# Altium project F1C100S.PrjPCB
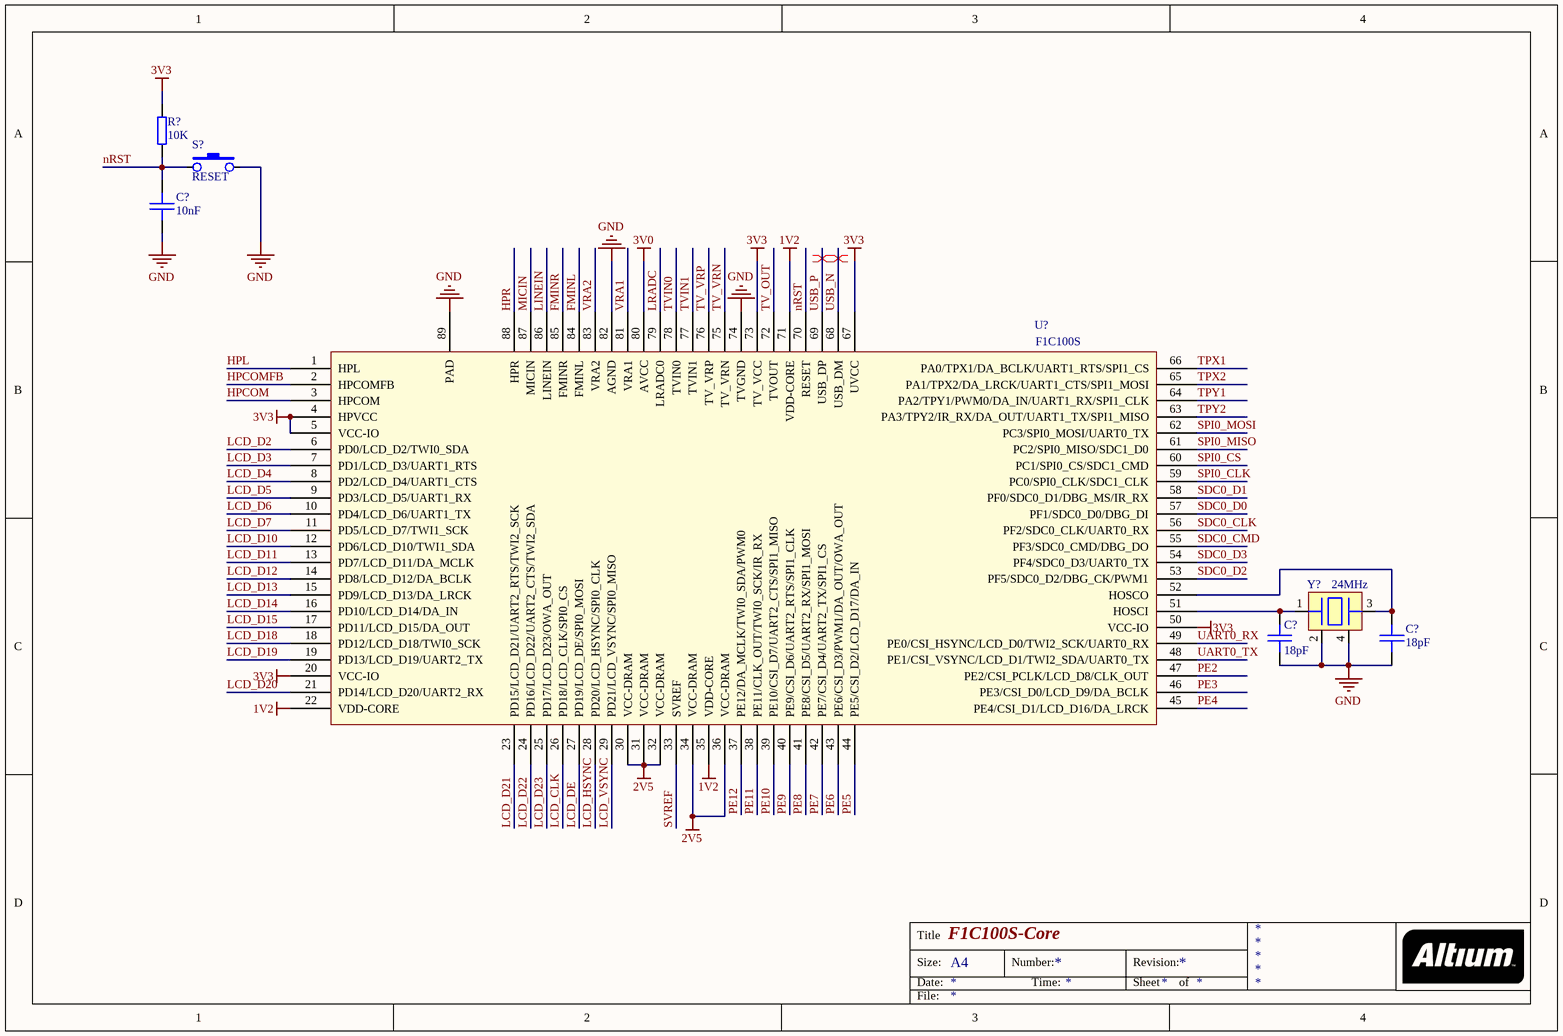
[diagram p0: Core.SchDoc]
5 sheets, 67 parts. Net scope: global (net labels, ports and power ports of the same name join across sheets).
Sheets:
  Core.SchDoc
  Power.SchDoc
  LCD.SchDoc
  Storage.SchDoc
  Misc.SchDoc

## Sheet Core.SchDoc: F1C100S-Core
size A4

### Parts
(Parts that share a designator on the sheet are numbered #1, #2 ... from top to bottom, then left to right.)
C?#1  10nF  [CAP-0603]
C?#2  18pF  [CAP-0603]
C?#3  18pF  [CAP-0603]
R?#1  10K  [RES-0603]
S?  RESET  [KEY_3X4X2]
U?#1  F1C100S  [QFN88-0.4]
Y?  24MHz  [LC-SMD-3225_4P]

### Nets
1V2: U?#1.22(VDD-CORE) U?#1.35(VDD-CORE) U?#1.71(VDD-CORE)
2V5: U?#1.30(VCC-DRAM) U?#1.31(VCC-DRAM) U?#1.32(VCC-DRAM) U?#1.34(VCC-DRAM) U?#1.36(VCC-DRAM)
3V0: U?#1.80(AVCC)
3V3: R?#1.2 U?#1.4(HPVCC) U?#1.5(VCC-IO) U?#1.20(VCC-IO) U?#1.50(VCC-IO) U?#1.67(UVCC) U?#1.73(TV_VCC)
GND: C?#1.2 C?#2.2 C?#3.2 S?.2 U?#1.74(TVGND) U?#1.82(AGND) U?#1.89(PAD) Y?.2 Y?.4
FMINL: U?#1.84(FMINL)
FMINR: U?#1.85(FMINR)
HPCOM: U?#1.3(HPCOM)
HPCOMFB: U?#1.2(HPCOMFB)
HPL: U?#1.1(HPL)
HPR: U?#1.88(HPR)
LCD_CLK: U?#1.26(PD18/LCD_CLK/SPI0_CS)
LCD_D2: U?#1.6(PD0/LCD_D2/TWI0_SDA)
LCD_D3: U?#1.7(PD1/LCD_D3/UART1_RTS)
LCD_D4: U?#1.8(PD2/LCD_D4/UART1_CTS)
LCD_D5: U?#1.9(PD3/LCD_D5/UART1_RX)
LCD_D6: U?#1.10(PD4/LCD_D6/UART1_TX)
LCD_D7: U?#1.11(PD5/LCD_D7/TWI1_SCK)
LCD_D10: U?#1.12(PD6/LCD_D10/TWI1_SDA)
LCD_D11: U?#1.13(PD7/LCD_D11/DA_MCLK)
LCD_D12: U?#1.14(PD8/LCD_D12/DA_BCLK)
LCD_D13: U?#1.15(PD9/LCD_D13/DA_LRCK)
LCD_D14: U?#1.16(PD10/LCD_D14/DA_IN)
LCD_D15: U?#1.17(PD11/LCD_D15/DA_OUT)
LCD_D18: U?#1.18(PD12/LCD_D18/TWI0_SCK)
LCD_D19: U?#1.19(PD13/LCD_D19/UART2_TX)
LCD_D20: U?#1.21(PD14/LCD_D20/UART2_RX)
LCD_D21: U?#1.23(PD15/LCD_D21/UART2_RTS/TWI2_SCK)
LCD_D22: U?#1.24(PD16/LCD_D22/UART2_CTS/TWI2_SDA)
LCD_D23: U?#1.25(PD17/LCD_D23/OWA_OUT)
LCD_DE: U?#1.27(PD19/LCD_DE/SPI0_MOSI)
LCD_HSYNC: U?#1.28(PD20/LCD_HSYNC/SPI0_CLK)
LCD_VSYNC: U?#1.29(PD21/LCD_VSYNC/SPI0_MISO)
LINEIN: U?#1.86(LINEIN)
LRADC: U?#1.79(LRADC0)
MICIN: U?#1.87(MICIN)
nRST: C?#1.1 R?#1.1 S?.1 U?#1.70(RESET)
PE2: U?#1.47(PE2/CSI_PCLK/LCD_D8/CLK_OUT)
PE3: U?#1.46(PE3/CSI_D0/LCD_D9/DA_BCLK)
PE4: U?#1.45(PE4/CSI_D1/LCD_D16/DA_LRCK)
PE5: U?#1.44(PE5/CSI_D2/LCD_D17/DA_IN)
PE6: U?#1.43(PE6/CSI_D3/PWM1/DA_OUT/OWA_OUT)
PE7: U?#1.42(PE7/CSI_D4/UART2_TX/SPI1_CS)
PE8: U?#1.41(PE8/CSI_D5/UART2_RX/SPI1_MOSI)
PE9: U?#1.40(PE9/CSI_D6/UART2_RTS/SPI1_CLK)
PE10: U?#1.39(PE10/CSI_D7/UART2_CTS/SPI1_MISO)
PE11: U?#1.38(PE11/CLK_OUT/TWI0_SCK/IR_RX)
PE12: U?#1.37(PE12/DA_MCLK/TWI0_SDA/PWM0)
SDC0_CLK: U?#1.56(PF2/SDC0_CLK/UART0_RX)
SDC0_CMD: U?#1.55(PF3/SDC0_CMD/DBG_DO)
SDC0_D0: U?#1.57(PF1/SDC0_D0/DBG_DI)
SDC0_D1: U?#1.58(PF0/SDC0_D1/DBG_MS/IR_RX)
SDC0_D2: U?#1.53(PF5/SDC0_D2/DBG_CK/PWM1)
SDC0_D3: U?#1.54(PF4/SDC0_D3/UART0_TX)
SPI0_CLK: U?#1.59(PC0/SPI0_CLK/SDC1_CLK)
SPI0_CS: U?#1.60(PC1/SPI0_CS/SDC1_CMD)
SPI0_MISO: U?#1.61(PC2/SPI0_MISO/SDC1_D0)
SPI0_MOSI: U?#1.62(PC3/SPI0_MOSI/UART0_TX)
SVREF: U?#1.33(SVREF)
TPX1: U?#1.66(PA0/TPX1/DA_BCLK/UART1_RTS/SPI1_CS)
TPX2: U?#1.65(PA1/TPX2/DA_LRCK/UART1_CTS/SPI1_MOSI)
TPY1: U?#1.64(PA2/TPY1/PWM0/DA_IN/UART1_RX/SPI1_CLK)
TPY2: U?#1.63(PA3/TPY2/IR_RX/DA_OUT/UART1_TX/SPI1_MISO)
TV_OUT: U?#1.72(TVOUT)
TV_VRN: U?#1.75(TV_VRN)
TV_VRP: U?#1.76(TV_VRP)
TVIN0: U?#1.78(TVIN0)
TVIN1: U?#1.77(TVIN1)
UART0_RX: U?#1.49(PE0/CSI_HSYNC/LCD_D0/TWI2_SCK/UART0_RX)
UART0_TX: U?#1.48(PE1/CSI_VSYNC/LCD_D1/TWI2_SDA/UART0_TX)
USB_N: U?#1.68(USB_DM)
USB_P: U?#1.69(USB_DP)
VRA1: U?#1.81(VRA1)
VRA2: U?#1.83(VRA2)
NetC?#2_1: C?#2.1 U?#1.51(HOSCI) Y?.1
NetC?#3_1: C?#3.1 U?#1.52(HOSCO) Y?.3

### Layout directives
differential pair: USB_N, USB_P

### Notes on the sheet
- Title
- Size:
- Date:
- A4
- Number:
- Time:
- Revision:
- Sheet
- of
- File:

### Library data of the parts
C?#1-C?#3 = C_0603: 陶瓷贴片电容0603; tolerance: 10%; voltage: 50V; ESR: 1.73mOhm; IRMS: 5.59A; Series: X7R
  C?#1: C_value: 10nF
  C?#2 C?#3: C_value: 18pF
R?#1 = R_0603: 贴片电阻0603; tolerance: 5%; voltage: 50V; power: 0.063W; R_value: 10K
S? = KEY: 轻触开关3X4X2
Y? = XTAL_PASSIVE: 贴片无源晶振(3225); X_value: 24MHz

## Sheet Power.SchDoc: F1C100S-Power
size A4
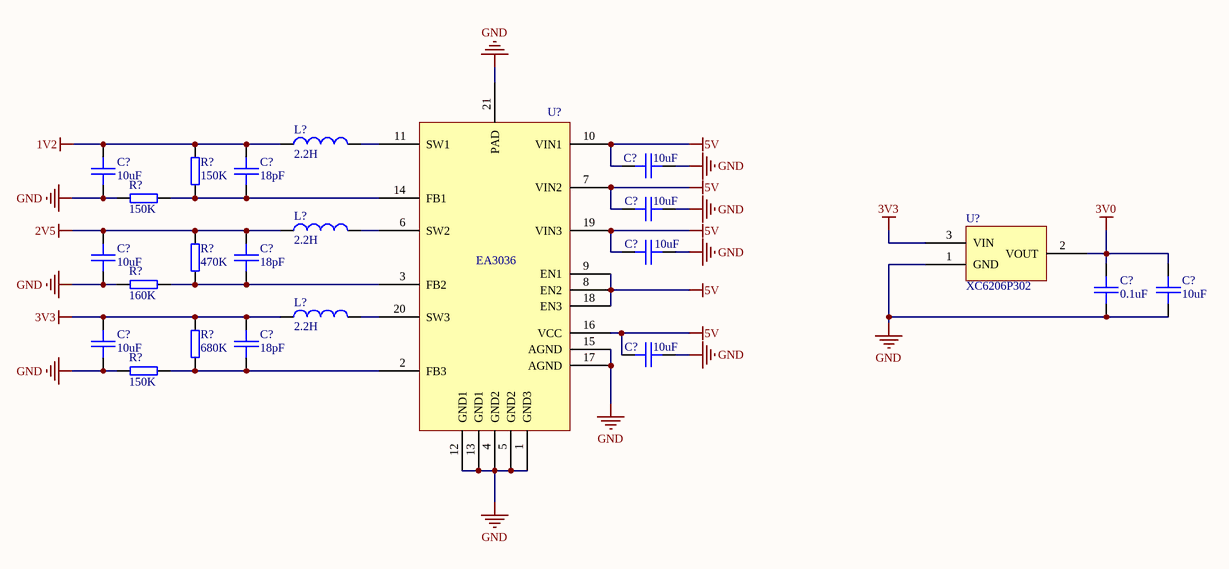
[diagram p1: Power.SchDoc]

### Parts
(Parts that share a designator on the sheet are numbered #1, #2 ... from top to bottom, then left to right.)
C?#4  10uF  [CAP-1206]
C?#5  18pF  [CAP-0603]
C?#6  10uF  [CAP-1206]
C?#7  10uF  [CAP-1206]
C?#8  10uF  [CAP-1206]
C?#9  10uF  [CAP-1206]
C?#10  18pF  [CAP-0603]
C?#11  0.1uF  [CAP-0603]
C?#12  10uF  [CAP-1206]
C?#13  10uF  [CAP-1206]
C?#14  18pF  [CAP-0603]
C?#15  10uF  [CAP-1206]
L?#1  2.2H  [L-PWR-6028]
L?#2  2.2H  [L-PWR-6028]
L?#3  2.2H  [L-PWR-6028]
R?#2  150K  [RES-0603]
R?#3  150K  [RES-0603]
R?#4  470K  [RES-0603]
R?#5  160K  [RES-0603]
R?#6  680K  [RES-0603]
R?#7  150K  [RES-0603]
U?#2  EA3036  [QFN20-3X3]
U?#3  XC6206P302  [SOT-23-3L]

### Nets
1V2: C?#4.2 C?#5.1 L?#1.1 R?#2.2
2V5: C?#9.2 C?#10.1 L?#2.1 R?#4.2
3V0: C?#11.1 C?#12.1 U?#3.2(VOUT)
3V3: C?#13.2 C?#14.1 L?#3.1 R?#6.2 U?#3.3(VIN)
5V: C?#6.2 C?#7.2 C?#8.2 C?#15.2 U?#2.7(VIN2) U?#2.8(EN2) U?#2.9(EN1) U?#2.10(VIN1) U?#2.16(VCC) U?#2.18(EN3) U?#2.19(VIN3)
GND: C?#4.1 C?#6.1 C?#7.1 C?#8.1 C?#9.1 C?#11.2 C?#12.2 C?#13.1 C?#15.1 R?#3.2 R?#5.2 R?#7.2 U?#2.1(GND3) U?#2.4(GND2) U?#2.5(GND2) U?#2.12(GND1) U?#2.13(GND1) U?#2.15(AGND) U?#2.17(AGND) U?#2.21(PAD) U?#3.1(GND)
NetC?#5_2: C?#5.2 R?#2.1 R?#3.1 U?#2.14(FB1)
NetC?#10_2: C?#10.2 R?#4.1 R?#5.1 U?#2.3(FB2)
NetC?#14_2: C?#14.2 R?#6.1 R?#7.1 U?#2.2(FB3)
NetL?#1_2: L?#1.2 U?#2.11(SW1)
NetL?#2_2: L?#2.2 U?#2.6(SW2)
NetL?#3_2: L?#3.2 U?#2.20(SW3)

### Notes on the sheet
- Title
- Size:
- Date:
- A4
- Number:
- Time:
- Revision:
- Sheet
- of
- File:

### Library data of the parts
C?#4 C?#6-C?#9 C?#12 C?#13 C?#15 = C_1206: 陶瓷贴片电容1206; tolerance: 10%; voltage: 50V; C_value: 10uF
C?#5 C?#10 C?#11 C?#14 = C_0603: as C?#1 on sheet Core; Series: X7R
  C?#5 C?#10 C?#14: C_value: 18pF
  C?#11: C_value: 0.1uF
L?#1-L?#3 = L_Power: 功率电感; DCR: 0.1Ohm; IDC: 2.7A; tolerance: 20%; L_value: 2.2H
R?#2-R?#7 = R_0603: as R?#1 on sheet Core
  R?#2 R?#3 R?#7: R_value: 150K
  R?#4: R_value: 470K
  R?#5: R_value: 160K
  R?#6: R_value: 680K
U?#2 = EA3036: 3CH Power Management IC
U?#3 = XC6206: XC6206 LDO=3V

## Sheet LCD.SchDoc: F1C100S-LCD
size A4
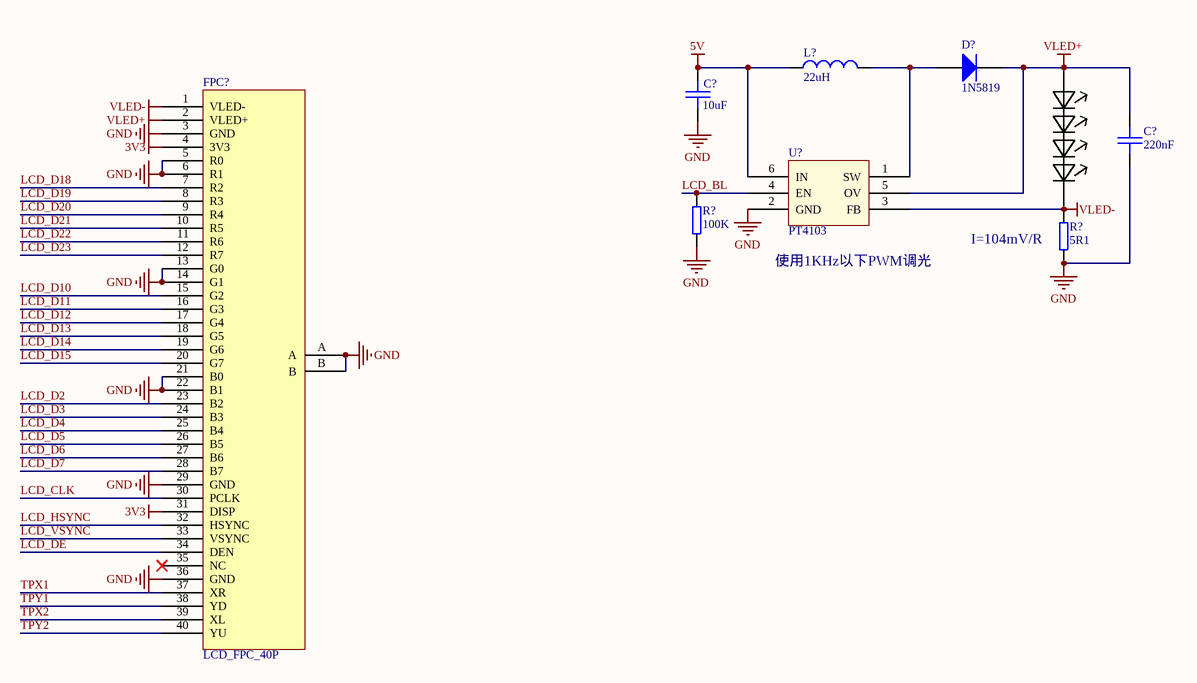
[diagram p2: LCD.SchDoc]

### Parts
(Parts that share a designator on the sheet are numbered #1, #2 ... from top to bottom, then left to right.)
C?#16  10uF  [CAP-1206]
C?#17  220nF  [CAP-0603]
D?  1N5819  [LC-SOD-123]
FPC?  LCD_FPC_40P  [FPC_40P]
L?#4  22uH  [L-PWR-06030]
R?#8  100K  [RES-0603]
R?#9  5R1  [RES-0603]
U?#4  PT4103  [SOT23-6]

### Nets
3V3: FPC?.4(3V3) FPC?.31(DISP)
5V: C?#16.2 L?#4.1 U?#4.6(IN)
GND: C?#16.1 C?#17.2 FPC?.3(GND) FPC?.5(R0) FPC?.6(R1) FPC?.13(G0) FPC?.14(G1) FPC?.21(B0) FPC?.22(B1) FPC?.29(GND) FPC?.36(GND) FPC?.A FPC?.B R?#8.1 R?#9.1 U?#4.2(GND)
VLED+: C?#17.1 D?.2(K) FPC?.2(VLED+) U?#4.5(OV)
VLED-: FPC?.1(VLED-) R?#9.2 U?#4.3(FB)
LCD_BL: R?#8.2 U?#4.4(EN)
LCD_CLK: FPC?.30(PCLK)
LCD_D2: FPC?.23(B2)
LCD_D3: FPC?.24(B3)
LCD_D4: FPC?.25(B4)
LCD_D5: FPC?.26(B5)
LCD_D6: FPC?.27(B6)
LCD_D7: FPC?.28(B7)
LCD_D10: FPC?.15(G2)
LCD_D11: FPC?.16(G3)
LCD_D12: FPC?.17(G4)
LCD_D13: FPC?.18(G5)
LCD_D14: FPC?.19(G6)
LCD_D15: FPC?.20(G7)
LCD_D18: FPC?.7(R2)
LCD_D19: FPC?.8(R3)
LCD_D20: FPC?.9(R4)
LCD_D21: FPC?.10(R5)
LCD_D22: FPC?.11(R6)
LCD_D23: FPC?.12(R7)
LCD_DE: FPC?.34(DEN)
LCD_HSYNC: FPC?.32(HSYNC)
LCD_VSYNC: FPC?.33(VSYNC)
TPX1: FPC?.37(XR)
TPX2: FPC?.39(XL)
TPY1: FPC?.38(YD)
TPY2: FPC?.40(YU)
NetD?_1: D?.1(A) L?#4.2 U?#4.1(SW)

Not connected (* = marked no-connect by the designer): FPC? 35(NC)*

### Notes on the sheet
- (near R?#9) I=104mV/R
- (near U?#4) 使用1KHz以下PWM调光
- Title
- Size:
- Date:
- A4
- Number:
- Time:
- Revision:
- Sheet
- of
- File:

### Library data of the parts
C?#16 = C_1206: 陶瓷贴片电容1206; tolerance: 10%; voltage: 50V; C_value: 10uF
C?#17 = C_0603: as C?#1 on sheet Core; C_value: 220nF; Series: X7R
D? = 1N5819: 肖特基二极管
FPC? = LCD_FPC_40P: 通用LCD连接器FPC40P
L?#4 = L_Power: as L?#1 on sheet Power; L_value: 22uH
R?#8 R?#9 = R_0603: as R?#1 on sheet Core
  R?#8: R_value: 100K
  R?#9: R_value: 5R1
U?#4 = PT4103: 液晶背光驱动芯片

## Sheet Storage.SchDoc: F1C100S-Storage
size A4
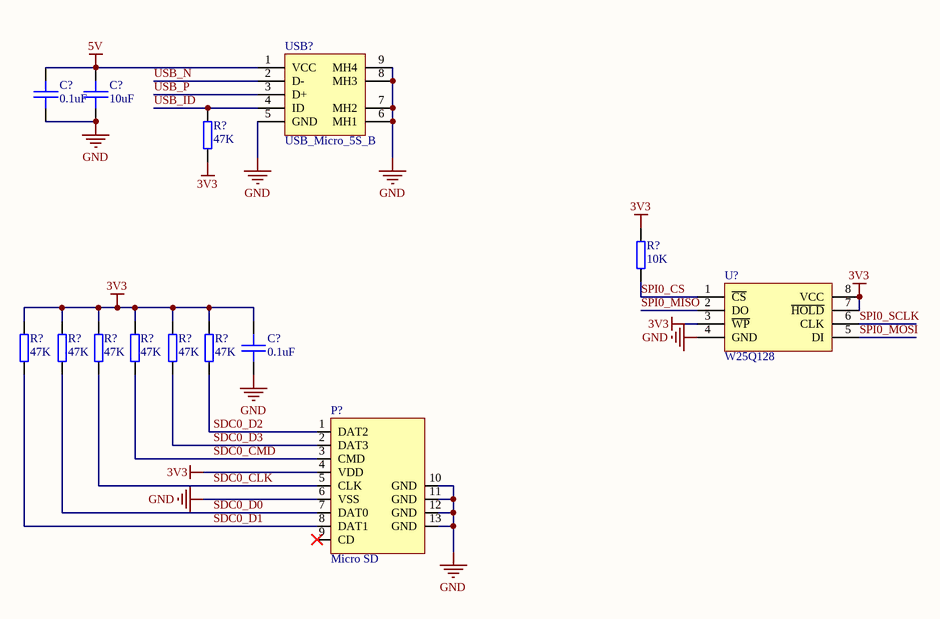
[diagram p3: Storage.SchDoc]

### Parts
(Parts that share a designator on the sheet are numbered #1, #2 ... from top to bottom, then left to right.)
C?#18  0.1uF  [CAP-0603]
C?#19  10uF  [CAP-1206]
C?#20  0.1uF  [CAP-0603]
P?  Micro SD  [7MSDP-B0-1012]
R?#10  47K  [RES-0603]
R?#11  10K  [RES-0603]
R?#12  47K  [RES-0603]
R?#13  47K  [RES-0603]
R?#14  47K  [RES-0603]
R?#15  47K  [RES-0603]
R?#16  47K  [RES-0603]
R?#17  47K  [RES-0603]
U?#5  W25Q128  [LC-SOP-8_208mil]
USB?  USB_Micro_5S_B  [USB_MICRO_5S_B]

### Nets
3V3: C?#20.1 P?.4(VDD) R?#10.2 R?#11.2 R?#12.2 R?#13.2 R?#14.2 R?#15.2 R?#16.2 R?#17.2 U?#5.3(~{WP}) U?#5.7(~{HOLD}) U?#5.8(VCC)
5V: C?#18.1 C?#19.1 USB?.1(VCC)
GND: C?#18.2 C?#19.2 C?#20.2 P?.6(VSS) P?.10(GND) P?.11(GND) P?.12(GND) P?.13(GND) U?#5.4(GND) USB?.5(GND) USB?.6(MH1) USB?.7(MH2) USB?.8(MH3) USB?.9(MH4)
SDC0_CLK: P?.5(CLK) R?#14.1
SDC0_CMD: P?.3(CMD) R?#15.1
SDC0_D0: P?.7(DAT0) R?#13.1
SDC0_D1: P?.8(DAT1) R?#12.1
SDC0_D2: P?.1(DAT2) R?#17.1
SDC0_D3: P?.2(DAT3) R?#16.1
SPI0_CS: R?#11.1 U?#5.1(~{CS})
SPI0_MISO: U?#5.2(DO)
SPI0_MOSI: U?#5.5(DI)
SPI0_SCLK: U?#5.6(CLK)
USB_ID: R?#10.1 USB?.4(ID)
USB_N: USB?.2(D-)
USB_P: USB?.3(D+)

Not connected (* = marked no-connect by the designer): P? 9(CD)*

### Notes on the sheet
- Title
- Size:
- Date:
- A4
- Number:
- Time:
- Revision:
- Sheet
- of
- File:

### Library data of the parts
C?#18 C?#20 = C_0603: as C?#1 on sheet Core; C_value: 0.1uF; Series: X7R
C?#19 = C_1206: 陶瓷贴片电容1206; tolerance: 10%; voltage: 50V; C_value: 10uF
P? = Micro SD: Micro SD卡座
R?#10-R?#17 = R_0603: as R?#1 on sheet Core
  R?#10 R?#12-R?#17: R_value: 47K
  R?#11: R_value: 10K
U?#5 = W25Q128: 128Mbits SPI Flash
USB? = USB_Micro_5S_B: micro USB母座5SB型

## Sheet Misc.SchDoc: F1C100S-Misc
size A4
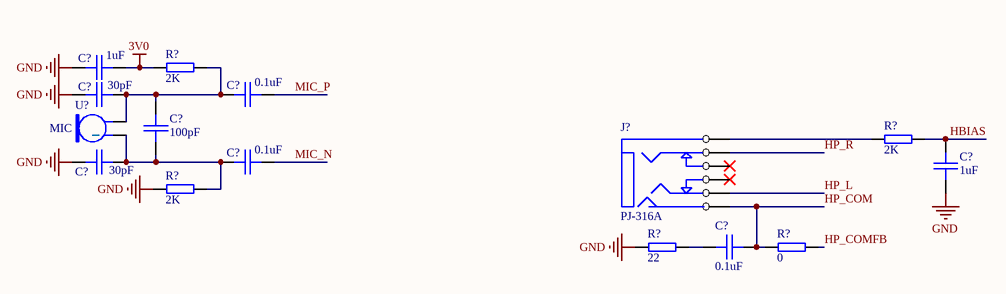
[diagram p4: Misc.SchDoc]

### Parts
(Parts that share a designator on the sheet are numbered #1, #2 ... from top to bottom, then left to right.)
C?#21  1uF  [CAP-0603]
C?#22  30pF  [CAP-0603]
C?#23  0.1uF  [CAP-0603]
C?#24  100pF  [CAP-0603]
C?#25  30pF  [CAP-0603]
C?#26  0.1uF  [CAP-0603]
C?#27  1uF  [CAP-0603]
C?#28  0.1uF  [CAP-0603]
J?  PJ-316A  [PJ-316A]
R?#18  2K  [RES-0603]
R?#19  2K  [RES-0603]
R?#20  2K  [RES-0603]
R?#21  22  [RES-0603]
R?#22  0  [RES-0603]
U?#6  MIC  [MIC_9767]

### Nets
3V0: C?#21.2 R?#18.1
GND: C?#21.1 C?#22.1 C?#25.1 C?#27.1 R?#20.1 R?#21.1
HBIAS: C?#27.2 R?#19.2
HP_COM: C?#28.2 J?.4(MIC) R?#22.1
HP_COMFB: R?#22.2
HP_L: J?.2(L)
HP_R: J?.3(R)
MIC_N: C?#26.2
MIC_P: C?#23.2
NetC?#22_2: C?#22.2 C?#23.1 C?#24.2 R?#18.2 U?#6.2
NetC?#24_1: C?#24.1 C?#25.2 C?#26.1 R?#20.2 U?#6.1
NetC?#28_1: C?#28.1 R?#21.2
NetJ?_1: J?.1(GND) R?#19.1

Not connected (* = marked no-connect by the designer): J? 5(L_DET)* 6(R_DET)*

### Notes on the sheet
- Title
- Size:
- Date:
- A4
- Number:
- Time:
- Revision:
- Sheet
- of
- File:

### Library data of the parts
C?#21-C?#28 = C_0603: as C?#1 on sheet Core; Series: X7R
  C?#21 C?#27: C_value: 1uF
  C?#22 C?#25: C_value: 30pF
  C?#23 C?#26 C?#28: C_value: 0.1uF
  C?#24: C_value: 100pF
J? = PJ-316A: 音频接口，左右声道+麦克
R?#18-R?#22 = R_0603: as R?#1 on sheet Core
  R?#18-R?#20: R_value: 2K
  R?#21: R_value: 22
  R?#22: R_value: 0
U?#6 = MIC: 咪头

## Nets that join several sheets
1V2: Core (U?#1.22 U?#1.35 U?#1.71), Power (C?#4.2 C?#5.1 L?#1.1 R?#2.2)
2V5: Core (5 pins), Power (C?#9.2 C?#10.1 L?#2.1 R?#4.2)
3V0: Core (U?#1.80), Power (C?#11.1 C?#12.1 U?#3.2), Misc (C?#21.2 R?#18.1)
3V3: Core (7 pins), Power (5 pins), LCD (FPC?.4 FPC?.31), Storage (13 pins)
5V: Power (11 pins), LCD (C?#16.2 L?#4.1 U?#4.6), Storage (C?#18.1 C?#19.1 USB?.1)
GND: Core (9 pins), Power (21 pins), LCD (16 pins), Storage (14 pins), Misc (6 pins)
LCD_CLK: Core (U?#1.26), LCD (FPC?.30)
LCD_D2: Core (U?#1.6), LCD (FPC?.23)
LCD_D3: Core (U?#1.7), LCD (FPC?.24)
LCD_D4: Core (U?#1.8), LCD (FPC?.25)
LCD_D5: Core (U?#1.9), LCD (FPC?.26)
LCD_D6: Core (U?#1.10), LCD (FPC?.27)
LCD_D7: Core (U?#1.11), LCD (FPC?.28)
LCD_D10: Core (U?#1.12), LCD (FPC?.15)
LCD_D11: Core (U?#1.13), LCD (FPC?.16)
LCD_D12: Core (U?#1.14), LCD (FPC?.17)
LCD_D13: Core (U?#1.15), LCD (FPC?.18)
LCD_D14: Core (U?#1.16), LCD (FPC?.19)
LCD_D15: Core (U?#1.17), LCD (FPC?.20)
LCD_D18: Core (U?#1.18), LCD (FPC?.7)
LCD_D19: Core (U?#1.19), LCD (FPC?.8)
LCD_D20: Core (U?#1.21), LCD (FPC?.9)
LCD_D21: Core (U?#1.23), LCD (FPC?.10)
LCD_D22: Core (U?#1.24), LCD (FPC?.11)
LCD_D23: Core (U?#1.25), LCD (FPC?.12)
LCD_DE: Core (U?#1.27), LCD (FPC?.34)
LCD_HSYNC: Core (U?#1.28), LCD (FPC?.32)
LCD_VSYNC: Core (U?#1.29), LCD (FPC?.33)
SDC0_CLK: Core (U?#1.56), Storage (P?.5 R?#14.1)
SDC0_CMD: Core (U?#1.55), Storage (P?.3 R?#15.1)
SDC0_D0: Core (U?#1.57), Storage (P?.7 R?#13.1)
SDC0_D1: Core (U?#1.58), Storage (P?.8 R?#12.1)
SDC0_D2: Core (U?#1.53), Storage (P?.1 R?#17.1)
SDC0_D3: Core (U?#1.54), Storage (P?.2 R?#16.1)
SPI0_CS: Core (U?#1.60), Storage (R?#11.1 U?#5.1)
SPI0_MISO: Core (U?#1.61), Storage (U?#5.2)
SPI0_MOSI: Core (U?#1.62), Storage (U?#5.5)
TPX1: Core (U?#1.66), LCD (FPC?.37)
TPX2: Core (U?#1.65), LCD (FPC?.39)
TPY1: Core (U?#1.64), LCD (FPC?.38)
TPY2: Core (U?#1.63), LCD (FPC?.40)
USB_N: Core (U?#1.68), Storage (USB?.2)
USB_P: Core (U?#1.69), Storage (USB?.3)